# EAGLE design lumiled_driver (EAGLE 8.3.1)
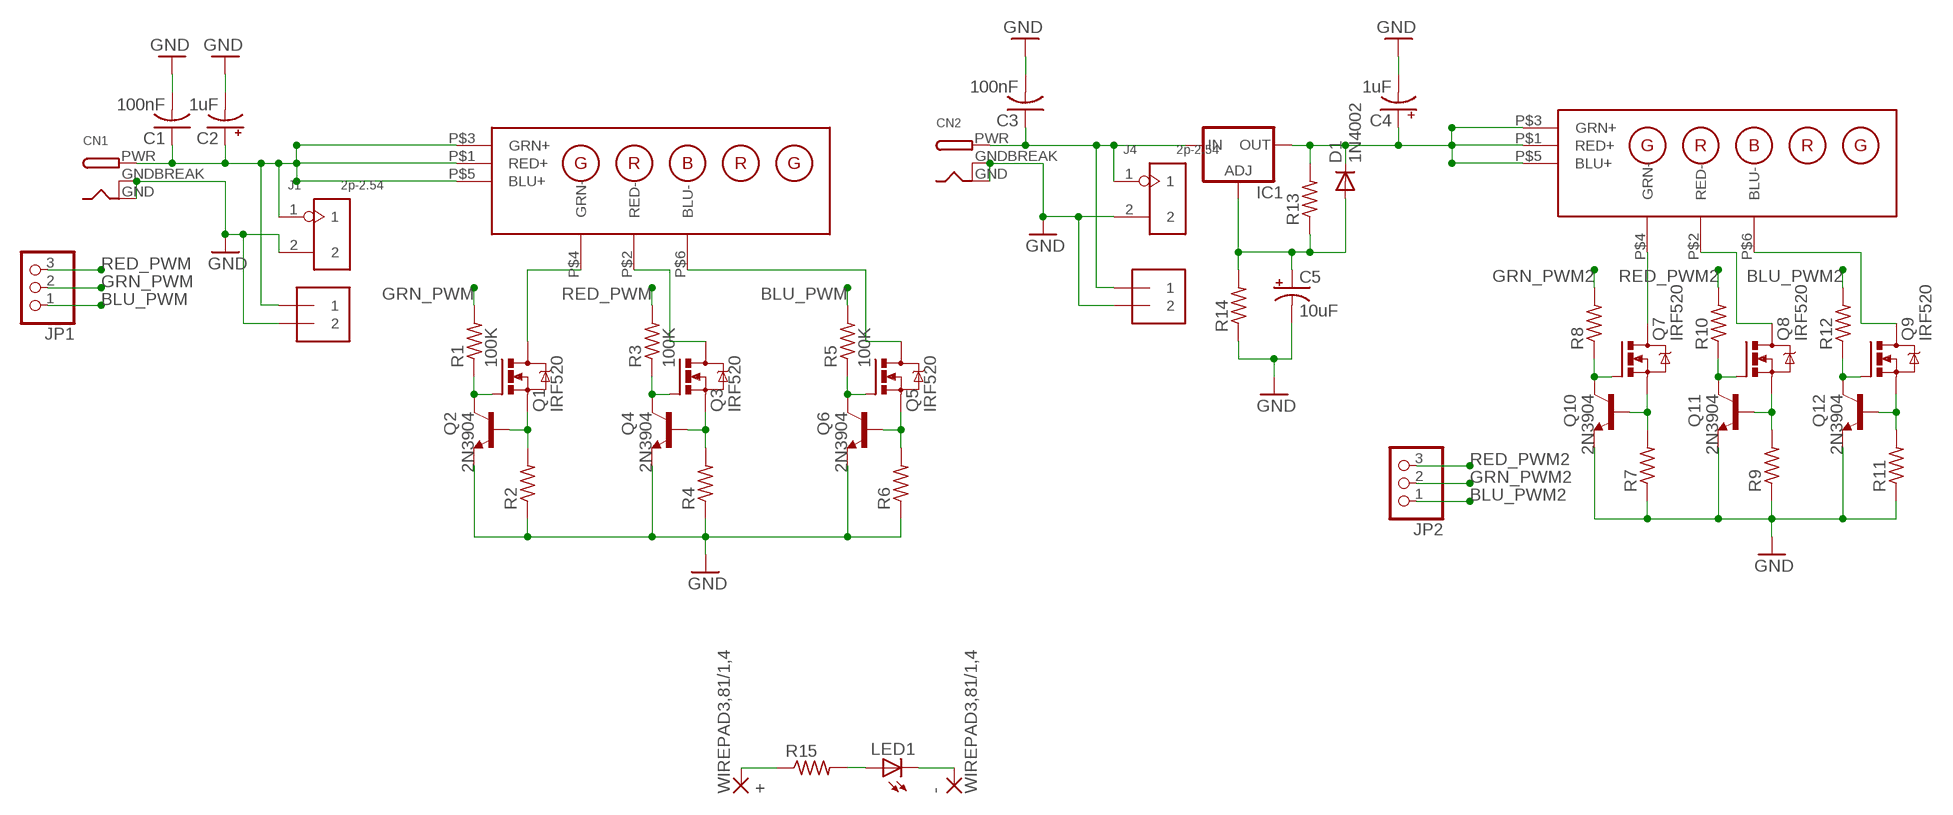
[diagram p0: schematic, sheet 1]

## Parts
+  WIREPAD3,81/1,4  [3,81/1,4]
-  WIREPAD3,81/1,4  [3,81/1,4]
C1  100nF  C-US025-024X044  [C025-024X044]
C2  1uF  CPOL-USTT2D5  [TT2D5]
C3  100nF  C-US025-024X044  [C025-024X044]
C4  1uF  CPOL-USTT2D5  [TT2D5]
C5  10uF  CPOL-USTT2D5  [TT2D5]
CN1  DCBARRELPTH  [DCJACK_2MM_PTH]
CN2  DCBARRELPTH  [DCJACK_2MM_PTH]
D1  1N4002  1N4004  [DO41-10]
IC1  LM317TL  [317TL]
J1  2p-2.54  DIP-BLACK-MALE-HEADER-VERT(2P-2.54)  [H2-2.54]
J2  1X2-3.5MM  [1X2-3.5MM]
J3  1X2-3.5MM  [1X2-3.5MM]
J4  2p-2.54  DIP-BLACK-MALE-HEADER-VERT(2P-2.54)  [H2-2.54]
JP1  PINHD-1X3  [1X03]
JP2  PINHD-1X3  [1X03]
LED1  LED3MM  [LED3MM]
Q1  IRF520  [TO220BV]
Q2  2N3904  [TO92]
Q3  IRF520  [TO220BV]
Q4  2N3904  [TO92]
Q5  IRF520  [TO220BV]
Q6  2N3904  [TO92]
Q7  IRF520  [TO220BV]
Q8  IRF520  [TO220BV]
Q9  IRF520  [TO220BV]
Q10  2N3904  [TO92]
Q11  2N3904  [TO92]
Q12  2N3904  [TO92]
R1  100K  R-US_0411/12  [0411/12]
R2  R-US_0411/12  [0411/12]
R3  100K  R-US_0411/12  [0411/12]
R4  R-US_0411/12  [0411/12]
R5  100K  R-US_0411/12  [0411/12]
R6  R-US_0411/12  [0411/12]
R7  R-US_0411/12  [0411/12]
R8  R-US_0411/12  [0411/12]
R9  R-US_0411/12  [0411/12]
R10  R-US_0411/12  [0411/12]
R11  R-US_0411/12  [0411/12]
R12  R-US_0411/12  [0411/12]
R13  R-US_0411/12  [0411/12]
R14  R-US_0411/12  [0411/12]
R15  R-US_0207/12  [0207/12]
U$1  LUMILED_PARALLEL  [LED_PAR]
U$2  LUMILED_PARALLEL  [LED_PAR]

## Nets
+VIN: C1.1 C2.+ CN1.PWR J1.1 J2.1 U$1.P$1(RED+) U$1.P$3(GRN+) U$1.P$5(BLU+)
+VIN1: C4.+ D1.C IC1.2(OUT) R13.2 U$2.P$1(RED+) U$2.P$3(GRN+) U$2.P$5(BLU+)
BLU_PWM: JP1.1 R5.2
BLU_PWM2: JP2.1 R12.2
GND: C1.2 C2.- C3.2 C4.- C5.- CN1.GND CN1.GNDBREAK CN2.GND CN2.GNDBREAK J1.2 J2.2 J3.2 J4.2 Q2.3(E) Q4.3(E) Q6.3(E) Q10.3(E) Q11.3(E) Q12.3(E) R2.1 R4.1 R6.1 R7.1 R9.1 R11.1 R14.1
GRN_PWM: JP1.2 R1.2
GRN_PWM2: JP2.2 R8.2
N$1: Q7.D U$2.P$4(GRN-)
N$2: Q7.G Q10.1(C) R8.1
N$3: Q8.G Q11.1(C) R10.1
N$4: Q9.G Q12.1(C) R12.1
N$5: Q7.S Q10.2(B) R7.2
N$6: Q8.S Q11.2(B) R9.2
N$7: Q9.S Q12.2(B) R11.2
N$8: Q8.D U$2.P$2(RED-)
N$9: Q9.D U$2.P$6(BLU-)
N$10: Q1.D U$1.P$4(GRN-)
N$11: C3.1 CN2.PWR IC1.3(IN) J3.1 J4.1
N$12: C5.+ D1.A IC1.1(ADJ) R13.1 R14.2
N$17: Q1.G Q2.1(C) R1.1
N$18: Q3.G Q4.1(C) R3.1
N$19: Q5.G Q6.1(C) R5.1
N$20: Q1.S Q2.2(B) R2.2
N$21: Q3.S Q4.2(B) R4.2
N$22: Q5.S Q6.2(B) R6.2
N$26: Q3.D U$1.P$2(RED-)
N$27: Q5.D U$1.P$6(BLU-)
N$41: LED1.A R15.2
N$42: +.1(P) R15.1
N$43: -.1(P) LED1.K(C)
RED_PWM: JP1.3 R3.2
RED_PWM2: JP2.3 R10.2

## Library data of the parts
+ - = wirepad:WIREPAD: Wire PAD connect wire on PCB
C1 C3 = rcl:C-US: CAPACITOR, American symbol
C2 C4 C5 = resistor:CPOL-US: POLARIZED CAPACITOR, American symbol
CN1 CN2 = adafruit:DCBARREL: 2.0mm DC Barrel Jack DCJACK_2MM_PTH - Through Hole Jack (4UConnector: 05537)
D1 = diode:1N4004: DIODE general purpose rectifier, 1 A
IC1 = v-reg:LM317TL: VOLTAGE REGULATOR
J1 J4 = Seeed-Connector:DIP-BLACK-MALE-HEADER-VERT(2P-2.54): 320020016; MPN: P125-1102A0BS116A1
J2 J3 = adafruit:1X2: 3.5mm Terminal block http://www.ladyada.net/library/pcb/eaglelibrary.html
JP1 JP2 = pinhead:PINHD-1X3: PIN HEADER
LED1 = led:LED: LED OSRAM: - CHIPLED LG R971, LG N971, LY N971, LG Q971, LY Q971, LO R971, LY R971 LH N974, LH R974 LS Q976, LO Q976, LY Q976 LO Q996 - Hyper CHIPLED LW Q18S LB Q993, LB Q99A, LB R99A - SideLED LS A670, LO A670, LY A670, LG A670, LP A670 LB A673, LV A673, LT A673, LW A673 LH A674 LY A675 LS A676, LA A676, LO A676, LY A676, LW A676 LS A679, LY A679, LG A679 - Hyper Micro SIDELED® LS Y876, LA Y876, LO Y876, LY Y876 LT Y87S - SmartLED LW L88C, LW L88S LB L89C, LB L89S, LG L890 LS L89K, LO L89K, LY L89K LS L896, LA L896, LO L896, LY L896 - TOPLED LS T670, LO T670, LY T670, LG T670, LP T670 LSG T670, LSP T670, LSY T670, LOP T670, LYG T670 LG T671, LOG T671, LSG T671 LB T673, LV T673, LT T673, LW T673 LH T674 LS T676, LA T676, LO T676, LY T676, LB T676, LH T676, LSB T676, LW T676 LB T67C, LV T67C, LT T67C, LS T67K, LO T67K, LY T67K, LW E67C LS E67B, LA E67B, LO E67B, LY E67B, LB E67C, LV E67C, LT E67C LW T67C LS T679, LY T679, LG T679 LS T770, LO T770, LY T770, LG T770, LP T770 LB T773, LV T773, LT T773, LW T773 LH T774 LS E675, LA E675, LY E675, LS T675 LS T776, LA T776, LO T776, LY T776, LB T776 LHGB T686 LT T68C, LB T68C - Hyper Mini TOPLED® LB M676 - Mini TOPLED Santana® LG M470 LS M47K, LO M47K, LY M47K Source: http://www.osram.convergy.de LUXEON: - LUMILED® LXK2-PW12-R00, LXK2-PW12-S00, LXK2-PW14-U00, LXK2-PW14-V00 LXK2-PM12-R00, LXK2-PM12-S00, LXK2-PM14-U00 LXK2-PE12-Q00, LXK2-PE12-R00, LXK2-PE12-S00, LXK2-PE14-T00, LXK2-PE14-U00 LXK2-PB12-K00, LXK2-PB12-L00, LXK2-PB12-M00, LXK2-PB14-N00, LXK2-PB14-P00, LXK2-PB14-Q00 LXK2-PR12-L00, LXK2-PR12-M00, LXK2-PR14-Q00, LXK2-PR14-R00 LXK2-PD12-Q00, LXK2-PD12-R00, LXK2-PD12-S00 LXK2-PH12-R00, LXK2-PH12-S00 LXK2-PL12-P00, LXK2-PL12-Q00, LXK2-PL12-R00 Source: www.luxeon.com KINGBRIGHT: KA-3528ASYC Source: www.kingbright.com
Q1 Q3 Q5 Q7-Q9 = transistor-power:IRF520: HEXFET Power MOSFET
Q2 Q4 Q6 Q10-Q12 = transistor-npn:2N3904: NPN Transistor
R1-R15 = resistor:R-US_: RESISTOR, American symbol
U$1 U$2 = lumiled_led:LUMILED_PARALLEL

## Board
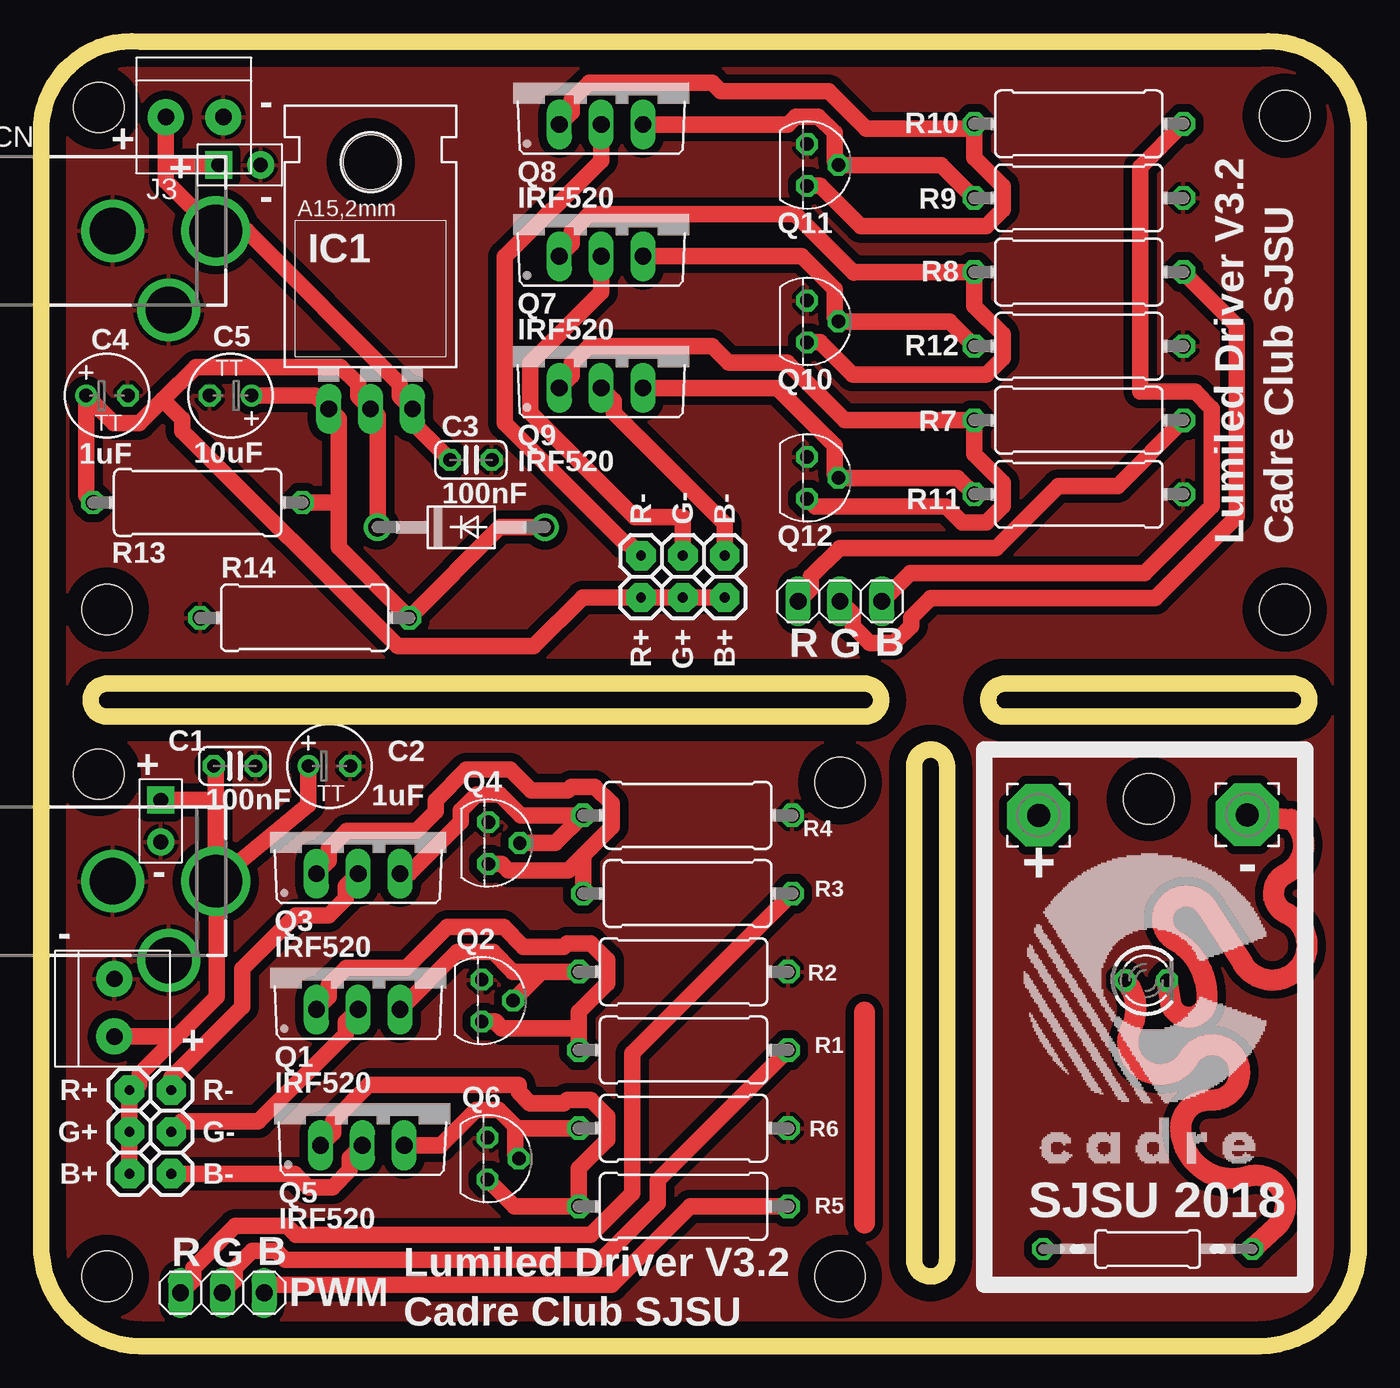
[diagram p1: board, top side]
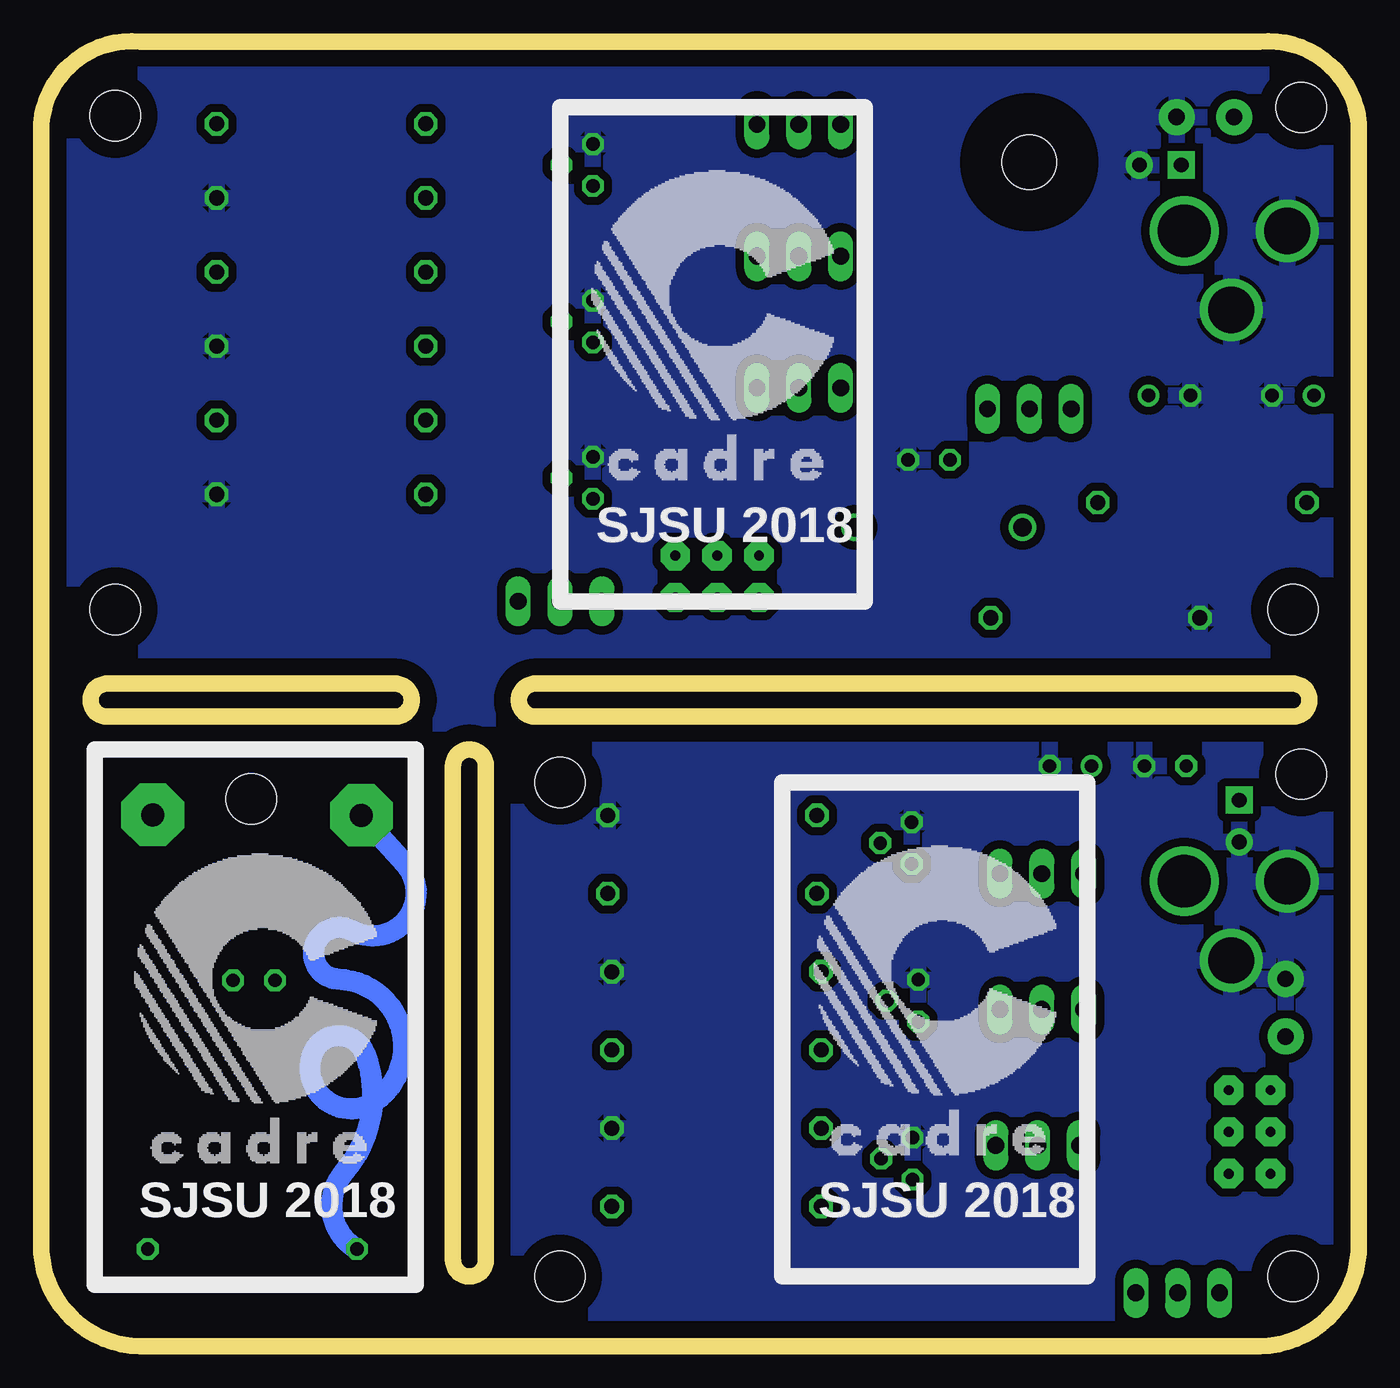
[diagram p2: board, bottom side, seen from below]

Size 80 x 79.27 mm. Coordinates in mm from the lower left corner, seen from the top.
Outline: 47.5,38.25 5,38.25
Outline: 0,34.25 0,6.25
Outline: 0,6.25 0,5.25
Outline: 0,74.75 0,74.25
Outline: 0,74.25 0,45.75
Outline: 0,74.25 arc-90 6,79.25
Outline: 74,79.25 arc-90 80,74.25
Outline: 6,0 arc-90 0,6.25
Outline: 6,0 74,0 arc90 80,6.25 80,74.25
Outline: 6,0 arc-90 0,6.25
Outline: 0,6.25 0,74.25
Outline: 0,74.25 arc-90 6,79.25
Outline: 6,79.25 74,79.25
Outline: 74,79.25 arc-90 80,74.25
Outline: 3,39.25 arc-90 4,40.25 50,40.25 arc-90 51,39.25 arc-90 50,38.25 4,38.25 arc-90 3,39.25
Outline: 54,4.25 arc-90 53,5.25 53,35.25 arc-90 54,36.25 arc-90 55,35.25 55,5.25 arc-90 54,4.25
Outline: 58.5,38.25 arc-90 57.5,39.25 arc-90 58.5,40.25 76,40.25 arc-90 77,39.25 arc-90 76,38.25 58.5,38.25
Copper layers (1*16): Top 0.035mm / dielectric 1.5mm / Bottom 0.035mm
Design rules "default *": minimum track width 40mil, minimum drill 0.35mm, track to track 20mil, track to pad 20mil, pad to pad 20mil, via to via 20mil, smd to smd 0mil, copper to edge 40mil, drill to drill 20mil, minimum pad ring 10mil, minimum via ring 8mil, stop-mask expansion 4mil, vias tented up to drill 0mil, thermal gap 10mil
Holes 3.05 mm at 4,4.25 48.5,4.25 48.5,34.25 3.5,34.75 4,44.75 75.5,44.75 75.5,74.75 3.5,75.25 67.25,33.25

### Footprints (pad centres in the part's own frame; a part is rotated, then mirrored left to right if it is on the bottom)
3,81/1,4 = drill 1.397 pad 3.81 octagon: 1 0,0
C025-024X044 = drill 0.813 octagon: 1 -1.27,0; 2 1.27,0
TT2D5 = drill 0.813: + -1.27,0 | drill 0.813 octagon: - 1.27,0
DCJACK_2MM_PTH = drill 2.8: GND 0,7.35; GNDBREAK 4.8,10.75 | drill 3.2: PWR 0,13.6
DO41-10 = drill 1.118: A 5.08,0; C -5.08,0
317TL = drill 1.016 long: 1 -2.54,-3.81; 2 0,-3.81; 3 2.54,-3.81 | hole 3.302: 0,11.176
H2-2.54 = drill 0.889 pad 1.651 square: 1 0,1.27 | drill 0.889 pad 1.651: 2 0,-1.27
1X2-3.5MM = drill 1 pad 2.184: 1 1.8,0; 2 -1.7,0
1X03 = drill 1.016 long: 1 -2.54,0; 2 0,0; 3 2.54,0
LED3MM = drill 0.813 octagon: A -1.27,0; K 1.27,0
TO220BV = drill 1.016 long: D 0,-2.54; G -2.54,-2.54; S 2.54,-2.54
TO92 = drill 0.813 octagon: 1 1.27,0; 2 0,1.905; 3 -1.27,0
0411/12 = drill 0.914 octagon: 1 -6.35,0; 2 6.35,0
0207/12 = drill 0.813 octagon: 1 -6.35,0; 2 6.35,0
LED_PAR = drill 0.6 pad 1.778 octagon: P$1 -5.08,-1.27; P$2 -5.08,1.27; P$3 -2.54,-1.27; P$4 -2.54,1.27; P$5 0,-1.27; P$6 0,1.27

### Placement (x,y rotation side)
+  60.56,32.26 0 top
-  73.23,32.29 0 top
C1  11.75,35.25 0 top
C2  17.5,35.25 0 top
C3  26.09,53.84 0 top
C4  4,57.75 0 top
C5  11.5,57.75 180 top
CN1  -3,28.25 270 top
CN2  -3,67.75 270 top
D1  25.5,49.75 0 top
IC1  20,60.75 0 top
J1  7.26,31.91 0 top
J2  4.44,20.62 270 top
J3  9.37,74.66 180 top
J4  12.05,71.75 90 top
JP1  11,3.25 180 top
JP2  48.5,45.25 0 top
LED1  67.08,22.22 0 top
Q1  19.25,23 0 top
Q2  26.75,21 270 top
Q3  19.25,31.25 0 top
Q4  27.15,30.57 270 top
Q5  19.5,14.75 0 top
Q6  27.1,11.4 270 top
Q7  34,68.75 0 top
Q8  34,76.75 0 top
Q9  34,60.75 0 top
Q10  46.5,62.25 270 top
Q11  46.5,71.75 270 top
Q12  46.5,52.75 270 top
R1  39,18 0 top
R2  39,22.75 180 top
R3  39.25,27.5 0 top
R4  39.25,32.25 180 top
R5  39,8.5 0 top
R6  39,13.25 180 top
R7  63,60.75 180 top
R8  63,65.25 0 top
R9  63,69.75 180 top
R10  63,74.25 0 top
R11  63,51.75 180 top
R12  63,56.25 0 top
R13  9.5,51.25 180 top
R14  16,44.25 0 top
R15  67.18,5.92 0 top
U$1  6.63,10.49 270 top
U$2  41.5,46.75 0 top

### Tracks (layer width: path | path; a pad name or v marks a point on that pad's centre or on a via)
+VIN
  Top 1.016: U$1.P$5 U$1.P$3 U$1.P$1 | U$1.P$1 5.71,15.92 5.97,15.92 5.61,15.57 U$1.P$1 | U$1.P$1 5.99,16.2 5.99,16.56 8.25,18.82 | 8.25,18.82 10.67,21.24 10.67,28.18 CN1.PWR | C1.1 10.6,35.13 10.6,33.4 | CN1.PWR 10.6,33.4 | CN1.PWR 16.23,32.88 C2.+ | J2.1 8.25,18.82 | J1.1 10.39,33.18 10.6,33.4
+VIN1
  Top 1.016: 7.38,57.49 9.37,59.48 18.2,59.48 19.24,58.44 19.24,57.7 IC1.2 20.42,56.52 D1.C | 7.38,57.49 5.96,56.07 4.41,56.07 C4.+ 2.73,51.67 R13.2 | 7.38,57.49 8.55,56.33 8.55,55.6 21.64,42.52 29.91,42.52 32.87,45.48 U$2.P$1 U$2.P$3 U$2.P$5
BLU_PWM
  Top 1.016: JP1.1 14.02,3.73 34.63,3.73 39.4,8.5 R5.2
BLU_PWM2
  Top 1.016: JP2.1 46.72,46.01 46.72,46.75 48.47,48.5 58,48.5 61.75,52.25 65.35,52.25 R12.2
GND
  pour Top: -2,81.25 -2,-0.75 82.5,-0.75 82.5,81.25
  pour Bottom: -3,-0.75 -2,81.25 82.5,81.25 82.5,-0.75
GRN_PWM
  Top 1.016: R1.2 37.42,10.07 37.42,8.68 34,5.25 14.82,5.25 14.28,5.79 12.8,5.79 11.76,4.75 11.76,4.01 JP1.2
GRN_PWM2
  Top 1.016: JP2.2 49.26,44.49 49.26,43.75 50.3,42.71 51.78,42.71 52.82,43.75 52.82,44.27 54,45.45 67.65,45.45 72.6,50.4 72.6,62 R8.2
N$1
  Top 1.016: U$2.P$4 38.96,50.36 36.03,50.36 29.68,56.71 29.68,59.71 34,64.03 Q7.D
N$2
  Top 1.016: Q7.G 32.22,66.97 32.22,67.71 33.26,68.75 45.8,68.75 49.32,65.22 49.35,65.25 R8.1 56.65,63.19 58.38,61.47 58.38,60.03 57.37,59.02 49.26,59.02 47.3,60.98 Q10.1
N$3
  Top 1.016: Q8.G 32.22,74.97 32.22,75.71 33.26,76.75 40.73,76.75 41.26,76.22 47.83,76.22 50.08,73.97 56.37,73.97 R10.1 56.65,72.19 58.38,70.47 58.38,69.03 57.37,68.02 49.76,68.02 47.3,70.48 Q11.1
N$4
  Top 1.016: Q9.G 32.22,58.97 32.22,59.71 33.26,60.75 40.73,60.75 41.75,59.73 45.31,59.73 48.8,56.25 R12.1 56.65,54.19 58.38,52.47 58.38,51.03 57.37,50.02 55.94,50.02 54.96,51 46.98,51 Q12.1
N$5
  Top 1.016: Q7.S 46.18,66.21 48.18,64.21 48.18,62.48 Q10.2 55.15,62.25 R7.2
N$6
  Top 1.016: Q8.S 45.32,74.21 45.81,74.7 47.19,74.7 48.18,73.71 48.18,71.98 Q11.2 54.65,71.75 R9.2
N$7
  Top 1.016: Q9.S 44.68,58.21 48.18,54.71 48.18,52.98 Q12.2 55.65,52.75 R11.2
N$8
  Top 1.016: U$2.P$2 35.61,48.83 35.4,48.83 28.16,56.08 28.16,66.18 34,72.03 Q8.D
N$9
  Top 1.016: Q9.D 34.76,57.45 34.76,56.71 41.5,49.97 U$2.P$6
N$10
  Top 1.016: U$1.P$4 8.53,13.66 13.19,13.66 18.49,18.96 18.49,19.7 Q1.D
N$11
  Top 1.016: C3.1 22.54,56.13 IC1.3 21.78,57.7 21.78,58.44 12.47,67.75 CN2.PWR 7.57,70.78 7.57,71.49 | 7.57,71.49 J3.1 | J4.1 7.83,71.75 7.57,71.49
N$12
  Top 1.016: 18.07,51.12 18.07,56.33 IC1.1 16.65,57.75 C5.+ | R13.1 17.93,51.25 18.07,51.12 | 18.07,51.12 18.07,48.53 R14.2 27.85,49.75 D1.A
N$17
  Top 1.016: Q1.G 17.47,21.22 17.47,21.96 18.51,23 22.18,23 24.64,25.47 28.08,25.47 29.27,24.27 31.73,24.27 31.93,24.48 33.37,24.48 34.38,23.46 34.38,22.04 32.65,20.31 32.65,19.27 | 32.65,19.27 R1.1 | Q2.1 27.55,19.73 27.96,19.32 32.6,19.32 32.65,19.27
N$18
  Top 1.016: 32.9,29.81 R3.1 | 32.9,29.81 34.63,31.54 34.63,32.97 33.62,33.98 32.19,33.98 31.98,33.77 29.74,33.77 28.47,35.04 25.82,35.04 23.95,33.17 23.95,32.48 22.77,31.3 18.57,31.3 17.47,30.21 17.47,29.47 Q3.G | Q4.1 27.95,29.3 28.36,28.89 31.99,28.89 32.9,29.81
N$19
  Top 1.016: Q5.G 17.72,12.97 17.72,13.71 19.89,15.87 28.98,15.87 28.98,15.46 29.67,14.77 31.73,14.77 31.93,14.98 33.37,14.98 34.38,13.96 34.38,12.54 32.65,10.81 R5.1 28.73,8.5 Q6.1
N$20
  Top 1.016: Q2.2 30.41,22.75 R2.2 28.64,22.75 27.44,23.95 25.28,23.95 Q1.S
N$21
  Top 1.016: Q4.2 31.22,30.57 R4.2 29.11,32.25 27.84,33.52 26.45,33.52 25.47,32.53 25.47,31.85 22.33,28.71 Q3.S
N$22
  Top 1.016: 28.77,13.37 27.79,14.35 26.4,14.35 24.26,12.21 Q5.S | Q6.2 28.77,11.63 28.77,13.37 | R6.2 28.89,13.25 28.77,13.37
N$26
  Top 1.016: Q3.D 18.49,27.95 18.49,27.21 17.45,26.17 15.97,26.17 15.96,26.18 15.44,26.18 12.2,22.94 12.2,20.61 7.9,16.31 U$1.P$2
N$27
  Top 1.016: Q5.D 18.74,11.45 18.74,10.71 17.7,9.67 16.22,9.67 15.41,10.49 U$1.P$6
N$41
  Top 1.27: R15.2 74.98,7.27 arc154 73.23,10.32 arc-105 69.19,13.21 arc-96 70.99,14.96 arc243 69.65,17.48 arc-177 66.19,19.36 arc69 LED1.A
N$42
  Bottom 1.27: +.1 57.91,29.32 arc161 61.14,25.25 arc-207 61.95,22.3 arc143 59.77,14.86 arc145 63.52,17.76 arc139 60.35,17.78 arc62 61.62,10.57 arc-101 R15.1
N$43
  Top 1.27: LED1.K 68.56,20.93 arc168 70.79,21.06 arc63 68.81,24.67 arc-208 70.74,26.7 72.97,23.22 arc213 75.62,26.29 arc-129 75.56,28.71 arc116 75.87,32.01 -.1
N$44
  Top 1.27: 49.99,20.3 49.99,7.5
RED_PWM
  Top 1.016: R3.2 35.9,17.8 35.9,9.31 33.37,6.77 15.45,6.77 14.91,7.31 11.79,7.31 9.22,4.75 9.22,4.01 JP1.3
RED_PWM2
  Top 1.016: JP2.3 52.77,46.98 67.02,46.98 71.08,51.03 71.08,56.97 70.06,57.98 66.72,57.98 66.72,71.62 R10.2

### Text on the board
tNames: - | + | + | - | Lumiled Driver V3.2 | Cadre Club SJSU | R | G | B | + | - | - | + | SJSU 2018 | R | G | B | Lumiled Driver V3.2 | PWM | Cadre Club SJSU
bNames: SJSU 2018 | SJSU 2018 | SJSU 2018